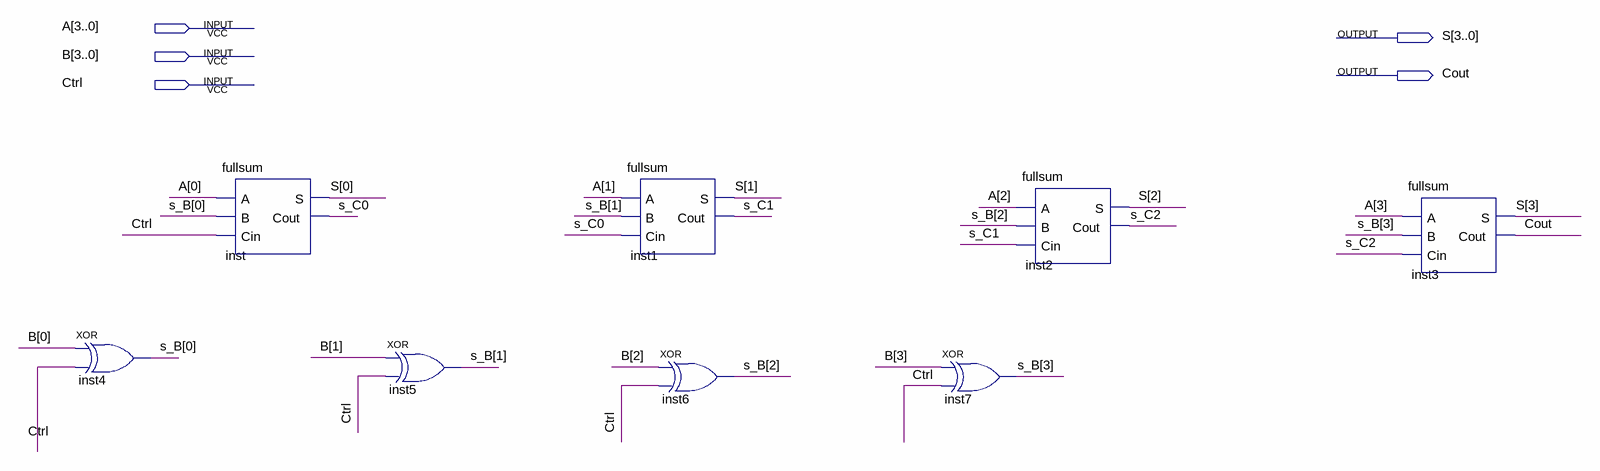
[diagram p0: schematic sheet]
// Quartus schematic ULA.bdf as structural Verilog: 8 symbols, 5 pins
module ULA (
  input  [3:0] A,
  input  [3:0] B,
  input  Ctrl,
  output [3:0] S,
  output Cout
);

  wire s_C0, s_C1, s_C2;
  wire [3:0] s_B;

  xor inst4 (s_B[0], B[0], Ctrl);
  fullsum inst (.A(A[0]), .B(s_B[0]), .Cin(Ctrl), .S(S[0]), .Cout(s_C0));
  xor inst5 (s_B[1], B[1], Ctrl);
  fullsum inst1 (.A(A[1]), .B(s_B[1]), .Cin(s_C0), .S(S[1]), .Cout(s_C1));
  xor inst6 (s_B[2], B[2], Ctrl);
  xor inst7 (s_B[3], B[3], Ctrl);
  fullsum inst2 (.A(A[2]), .B(s_B[2]), .Cin(s_C1), .S(S[2]), .Cout(s_C2));
  fullsum inst3 (.A(A[3]), .B(s_B[3]), .Cin(s_C2), .S(S[3]), .Cout(Cout));
endmodule
